# Altium schematic sheet Bridge.SchDoc: Primary Side Hardware - Bridge Converter
size A4; Author: Suzanne Lo; Revision: A; SheetNumber: 1; SheetTotal: 3
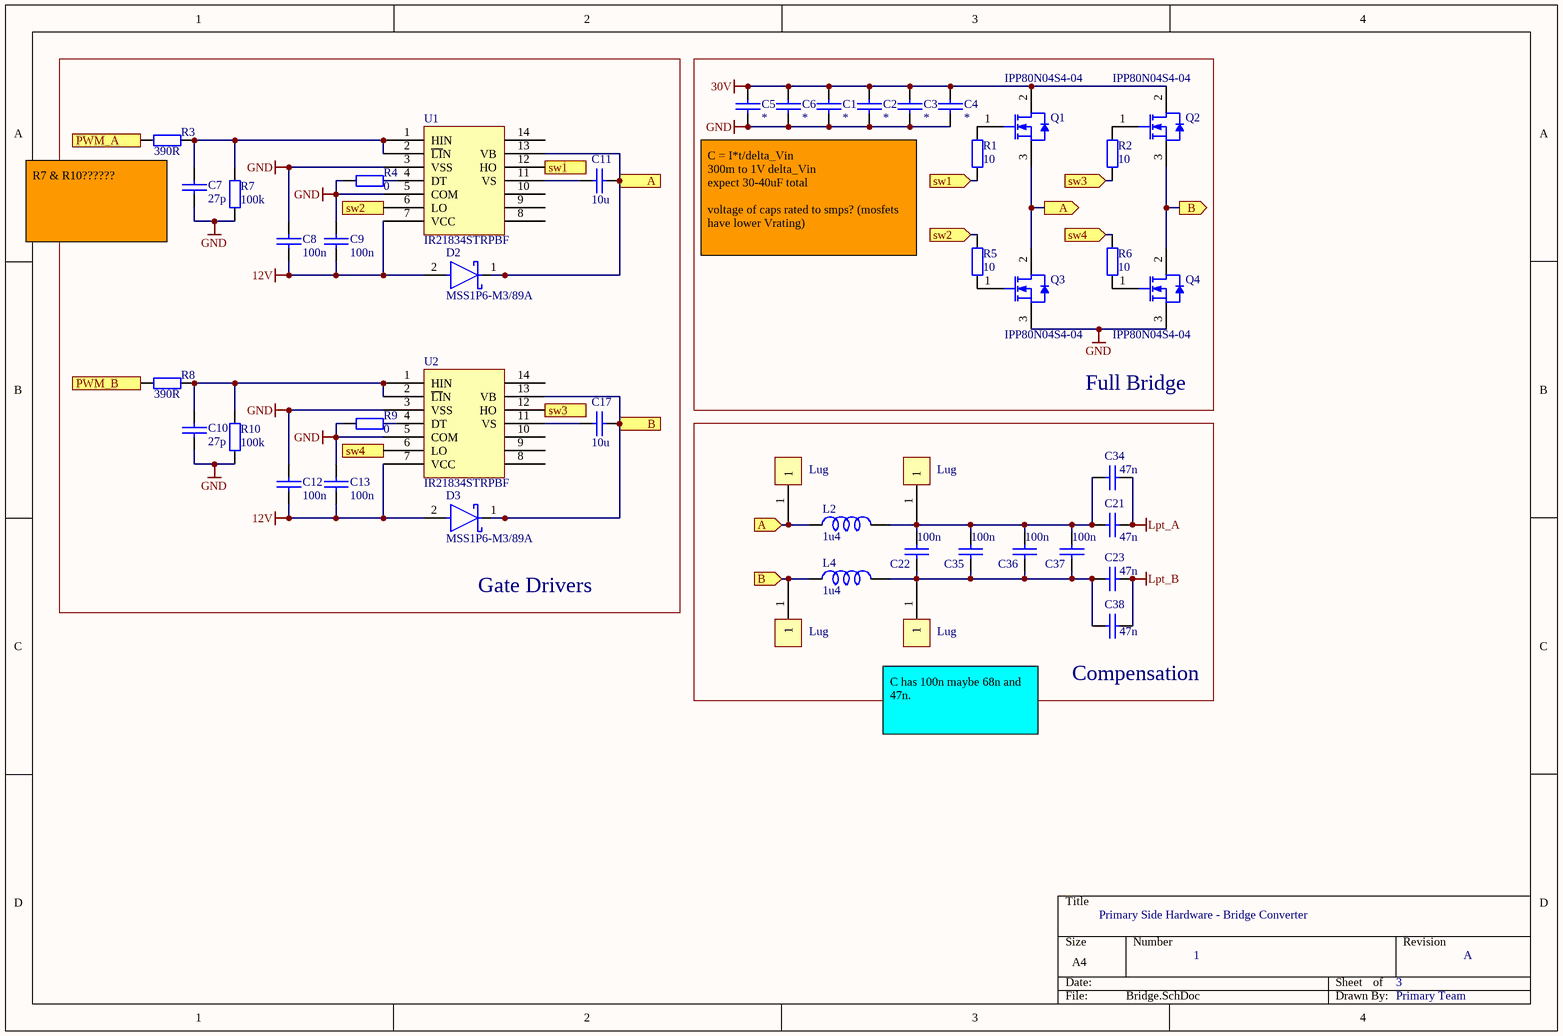
[diagram p0: Bridge.SchDoc]

## Parts
C1  *  [C1210]
C2  *  [C1210]
C3  *  [C1210]
C4  *  [C1210]
C5  *  [C1210]
C6  *  [C1210]
C7  27p  [C0805]
C8  100n  [C1210]
C9  100n  [C1210]
C10  27p  [C0805]
C11  10u  [C1210]
C12  100n  [C1210]
C13  100n  [C1210]
C17  10u  [C1210]
C21  47n  [C5750]
C22  100n  [C5750]
C23  47n  [C5750]
C34  47n  [C5750]
C35  100n  [C5750]
C36  100n  [C5750]
C37  100n  [C5750]
C38  47n  [C5750]
D2  MSS1P6-M3/89A  [FP-96591-MFG]
D3  MSS1P6-M3/89A  [FP-96591-MFG]
L2  1u4  [EFD20]
L4  1u4  [EFD20]
P6  Lug  [M3 Lug]
P7  Lug  [M3 Lug]
P8  Lug  [M3 Lug]
P9  Lug  [M3 Lug]
Q1  IPP80N04S4-04  [INF-PG-TO220-3-1]
Q2  IPP80N04S4-04  [INF-PG-TO220-3-1]
Q3  IPP80N04S4-04  [INF-PG-TO220-3-1]
Q4  IPP80N04S4-04  [INF-PG-TO220-3-1]
R1  10  [R1206]
R2  10  [R1206]
R3  390R  [R0805]
R4  0  [R0805]
R5  10  [R1206]
R6  10  [R1206]
R7  100k  [R0805]
R8  390R  [R0805]
R9  0  [R0805]
R10  100k  [R0805]
U1  IR21834STRPBF  [SOIC127P600X175-14N]
U2  IR21834STRPBF  [SOIC127P600X175-14N]

## Blocks framed on the sheet
Gate Drivers: C7-C13 C17 D2 D3 R3 R4 R7-R10 U1 U2
Full Bridge: C1-C6 Q1-Q4 R1 R2 R5 R6
Compensation: C21-C23 C34-C38 L2 L4 P6-P9

## Ports
A (in), A (out), B (in), B (out), PWM_A (in), PWM_B (in), sw1 (in), sw1 (out), sw2 (in), sw2 (out), sw3 (in), sw3 (out), sw4 (in), sw4 (out)

## Nets
12V: C8.2 C9.2 C12.2 C13.2 D2.2(A) D3.2(A) U1.7(VCC) U2.7(VCC)
30V: C1.1 C2.1 C3.1 C4.2 C5.1 C6.1 Q1.2(DRAIN) Q2.2(DRAIN)
GND: C1.2 C2.2 C3.2 C4.1 C5.2 C6.2 C7.2 C8.1 C9.1 C10.2 C12.1 C13.1 Q3.3(SOURCE) Q4.3(SOURCE) R4.2 R7.1 R9.1 R10.1 U1.3(VSS) U1.5(COM) U2.3(VSS) U2.5(COM)
Lpt_A: C21.2 C34.2
Lpt_B: C23.2 C38.2
A: C11.1 D2.1(C) L2.1 P6.1 Q1.3(SOURCE) Q3.2(DRAIN) U1.13(VB) ; port A
B: C17.1 D3.1(C) L4.1 P8.1 Q2.3(SOURCE) Q4.2(DRAIN) U2.13(VB) ; port B
PWM_A: R3.1 ; port PWM_A
PWM_B: R8.1 ; port PWM_B
sw1: R1.1 U1.12(HO) ; port sw1
sw2: R5.2 U1.6(LO) ; port sw2
sw3: R2.1 U2.12(HO) ; port sw3
sw4: R6.2 U2.6(LO) ; port sw4
NetC7_1: C7.1 R3.2 R7.2 U1.1(HIN) U1.2(~{LI}N)
NetC10_1: C10.1 R8.2 R10.2 U2.1(HIN) U2.2(~{LI}N)
NetC11_2: C11.2 U1.11(VS)
NetC17_2: C17.2 U2.11(VS)
NetC21_1: C21.1 C22.2 C34.1 C35.2 C36.2 C37.2 L2.2 P7.1
NetC22_1: C22.1 C23.1 C35.1 C36.1 C37.1 C38.1 L4.2 P9.1
NetQ1_1: Q1.1(GATE) R1.2
NetQ2_1: Q2.1(GATE) R2.2
NetQ3_1: Q3.1(GATE) R5.1
NetQ4_1: Q4.1(GATE) R6.1
NetR4_1: R4.1 U1.4(DT)
NetR9_2: R9.2 U2.4(DT)

Not connected (* = marked no-connect by the designer): U1 8 9 10 14; U2 8 9 10 14

## Notes on the sheet
- R7 & R10??????
- C = I*t/delta_Vin
  300m to 1V delta_Vin
  expect 30-40uF total
  voltage of caps rated to smps? (mosfets have lower Vrating)
- (near P9) C has 100n maybe 68n and 47n.
- Primary Team

## Library data of the parts
C1-C13 C17 C21-C23 C34-C38 = CerCap_SMT: SMT ceramic capacitor selectable size
  C1-C6: Value: *
  C7 C10: Value: 27p
  C8 C9 C12 C13 C22 C35-C37: Value: 100n
  C11 C17: Value: 10u
  C21 C23 C34 C38: Value: 47n
D2 D3 = MSS1P6-M3/89A: DIODE SCHOTTKY 60V 1A MICROSMP; Manufacturer: Vishay; Max Junction Temp: +150°C; Peak Reverse Current: 20uA; Max Surge Forward Current: 25A; Capacitance: 40pF; Value: 40pF; Temperature Range Low: -55°C; Automotive: No; Manufacturer Part Number: MSS1P6-M3/89A; ComponentLink2Description: Datasheet; RoHS: TRUE; Temperature Range High: +150°C; Forward Current: 1A; Height: 0.73mm; Max Repetitive Reverse Voltage: 60V; Device Class L2: Diodes; Octopart: https://octopart.com/mss1p6-m3%2F89a-vishay-42763284; Digikey Description: DIODE SCHOTTKY 60V 1A MICROSMP; Device Class L1: Discrete Semiconductors; Package: 96591; ComponentLink2URL: http://www.vishay.com/docs/89018/mss1p6.pdf; Category: Diode; Temperature: -55°C to +150°C; Footprint Url: http://www.vishay.com/docs/96591/microsmp_do-219ad_fredpt.pdf; Mouser Description: Schottky Diodes & Rectifiers 1.0 Amp 60 Volt; Device Class L3: Schottky Diodes; Lead Free: Yes
L2 L4 = L: Value: 1u4
Q1-Q4 = IPP80N04S4-04: OptiMOS-T2 Power-Transistor, 40 V VDS, 80 A ID, PG-TO220-3-1, Tube, Green; Manufacturer: Infineon; VDS (max): 40 V; RDS (on) (max) (@10V): 4.6 mOhm; Ptot (max): 71 W; IDpuls (max): 320 A; Green: TRUE; VGS(th) (max): 4 V; QG: 33 nC; RthJC (max): 2.1 K/W; ID (max): 80 A; VGS(th) (min): 2 V; PartNumber: IPP80N04S4-04; ComponentLink2Description: Datasheet; DatasheetVersion: Rev. 1.0; Halogen-free: TRUE; ComponentLink3Description: Package Specification; PackageDescription: 3-Pin Plastic (Green) Transistor Single Outline Package, 10 x 9.25 mm Body, 2.54 mm Pitch; ComponentLink3URL: http://www.infineon.com/dgdl/BTS117_DS_14.pdf?folderId=db3a30431400ef68011421b54e2e0564&fileId=db3a30433a747525013abff8302d549c&location=en.Products.Automotive_ICs.Smart_High-_and_Low-Side_Switches.HITFET___TEMPFET__-_Smart_Low-Side_Switches.DATASHEET.BTS1; PackageReference: PG-TO220-3-1; PackageVersion: Jul-12; Packing: Tube; ComponentLink1Description: Manufacturer URL; ComponentLink2URL: http://www.infineon.com/dgdl/IPP_B_I80N04S4-04_DS_1_0.pdf?folderId=db3a304412b407950112b42b75b74520&fileId=db3a304328c6bd5c01291c71d4085dfa&location=en.Products.Automotive_ICs.Automotive_MOSFETs.Single__N-Channel_40V_MOSFETs.DATASHEET.IPP_B_I80N04S4-04_DS_; Mounting Technology: Through Hole; ComponentLink1URL: http://www.infineon.com/; Technology: OptiMOS-T2
R1-R10 = Res_SMT: 0805 or 1206 resistor; Published: 8-Jun-2000; LatestRevisionDate: 17-Jul-2002; LatestRevisionNote: Re-released for DXP Platform.; PackageReference: AXIAL-0.4; Publisher: Altium Limited; ComponentLink1Description: https://nz.mouser.com/datasheet/2/315/AOA0000C304-1149620.pdf
  R1 R2 R5 R6: Value: 10
  R3 R8: Value: 390R
  R4 R9: Value: 0
  R7 R10: Value: 100k
U1 U2 = IR21834STRPBF: 600 V half-bridge gate driver IC with programmable deadtime, SOIC 14N, RoHS; Manufacturer: International Rectifier; Number of Outputs: 2; Max Supply Voltage: 20V; Min Supply Voltage: 10V; Max Power Dissipation: 1W; Turn-On Delay Time: 35ns; Max Supply Current: 1.6mA; Rise Time: 60ns; Output Current: 1.9A; Nominal Supply Current: 1mA; Propagation Delay: 330ns; Max Output Current: 2.3A; Supplier 1: Newark; Manufacturer Part Number: IR21834STRPBF; RoHS: Yes; Category: Gate Drivers; Mount: Surface Mount; Case/Package: SOIC; Number of Pins: 14; Min Operating Temperature: -40°C; Max Operating Temperature: 125°C; Packaging: Tape and Reel; Package Quantity: 1; Series: -; Output Voltage: 20V; Number of Drivers: 2; Fall Time: 35ns; Turn-Off Delay Time: 35ns; Power Dissipation: 1W; Length: 8.74mm; Width: 3.99mm; Height: 1.5mm; REACH SVHC: No SVHC; RoHS Compliant: Yes; ComponentLink1URL: https://datasheet.ciiva.com/26878/ir21834strpbf-26878870.pdf?src-supplier=IIIC; ComponentLink1Description: https://datasheet.ciiva.com/26878/ir21834strpbf-26878870.pdf?src-supplier=IIIC; ComponentLink2URL: https://datasheet.ciiva.com/8068/ir2183-8068250.pdf?src-supplier=Element14; ComponentLink2Description: https://datasheet.ciiva.com/8068/ir2183-8068250.pdf?src-supplier=Element14; ComponentLink3URL: https://datasheet.ciiva.com/1950/ir2183-1950222.pdf?src-supplier=Digi-Key; ComponentLink3Description: https://datasheet.ciiva.com/1950/ir2183-1950222.pdf?src-supplier=Digi-Key; ComponentLink4URL: https://datasheet.ciiva.com/1950/ir2183-1950223.pdf?src-supplier=Digi-Key; ComponentLink4Description: https://datasheet.ciiva.com/1950/ir2183-1950223.pdf?src-supplier=Digi-Key; ComponentLink5URL: https://datasheet.ciiva.com/1950/ir2183-1950221.pdf?src-supplier=Digi-Key; ComponentLink5Description: https://datasheet.ciiva.com/1950/ir2183-1950221.pdf?src-supplier=Digi-Key; ComponentLink6URL: https://datasheet.ciiva.com/16287/ir2183-16287545.pdf?src-supplier=Future+Electronics; ComponentLink6Description: https://datasheet.ciiva.com/16287/ir2183-16287545.pdf?src-supplier=Future+Electronics